# Altium schematic sheet 08_Display_Leds.SchDoc
size 558 x 431 mm
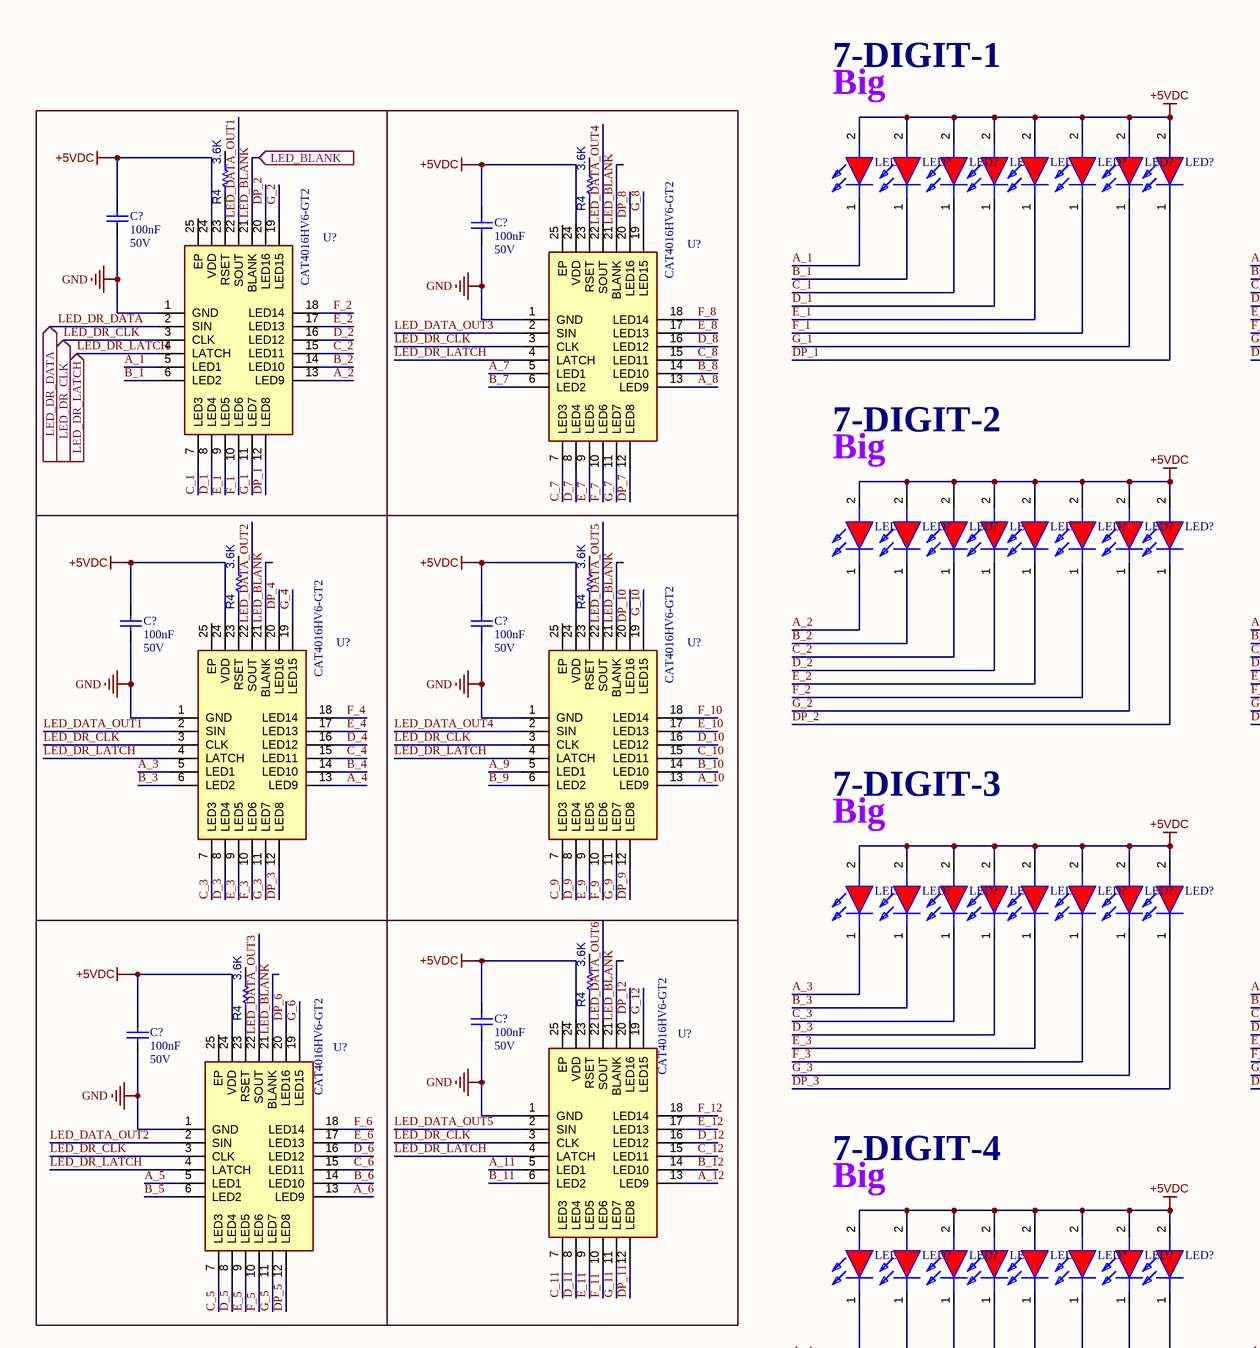
[diagram p0: 08_Display_Leds.SchDoc, top left]
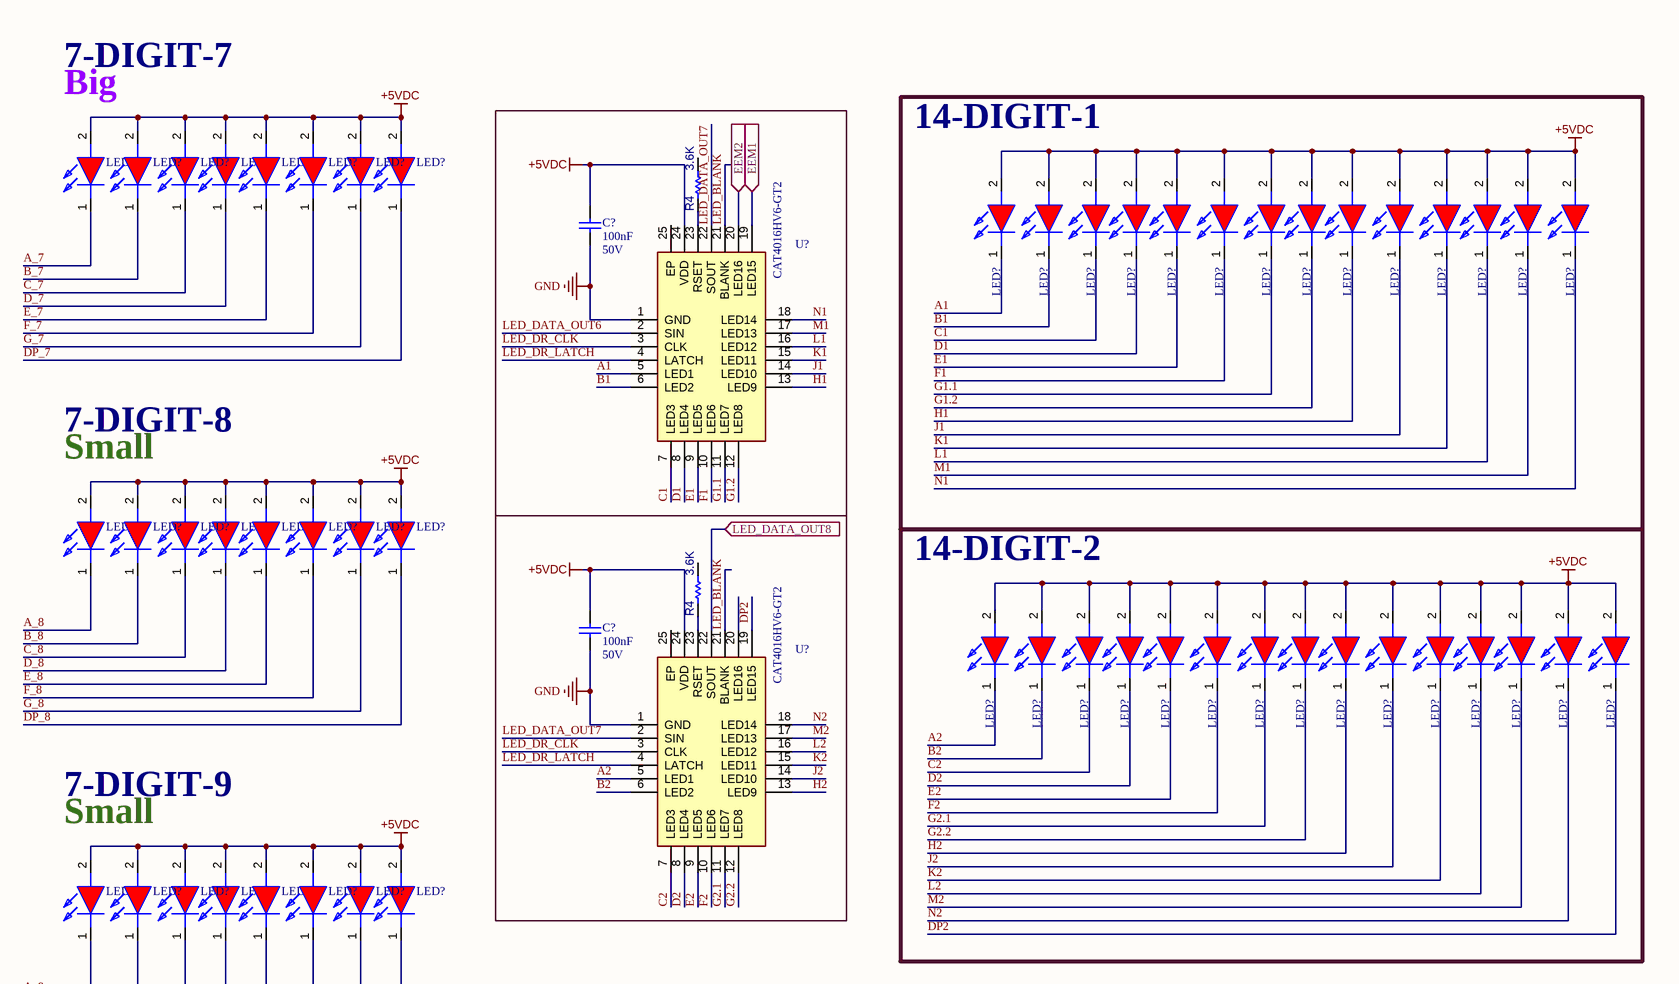
[diagram p1: 08_Display_Leds.SchDoc, top right]
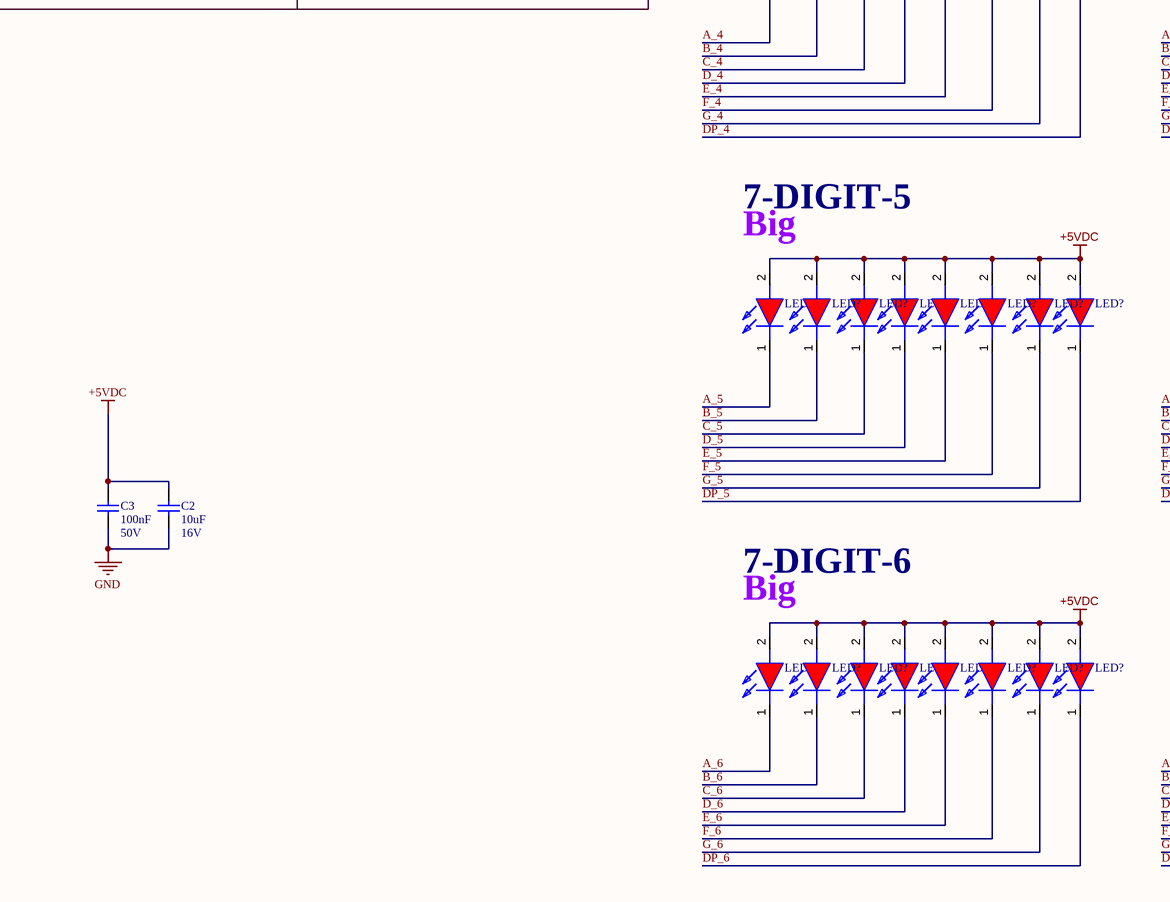
[diagram p2: 08_Display_Leds.SchDoc, bottom left]
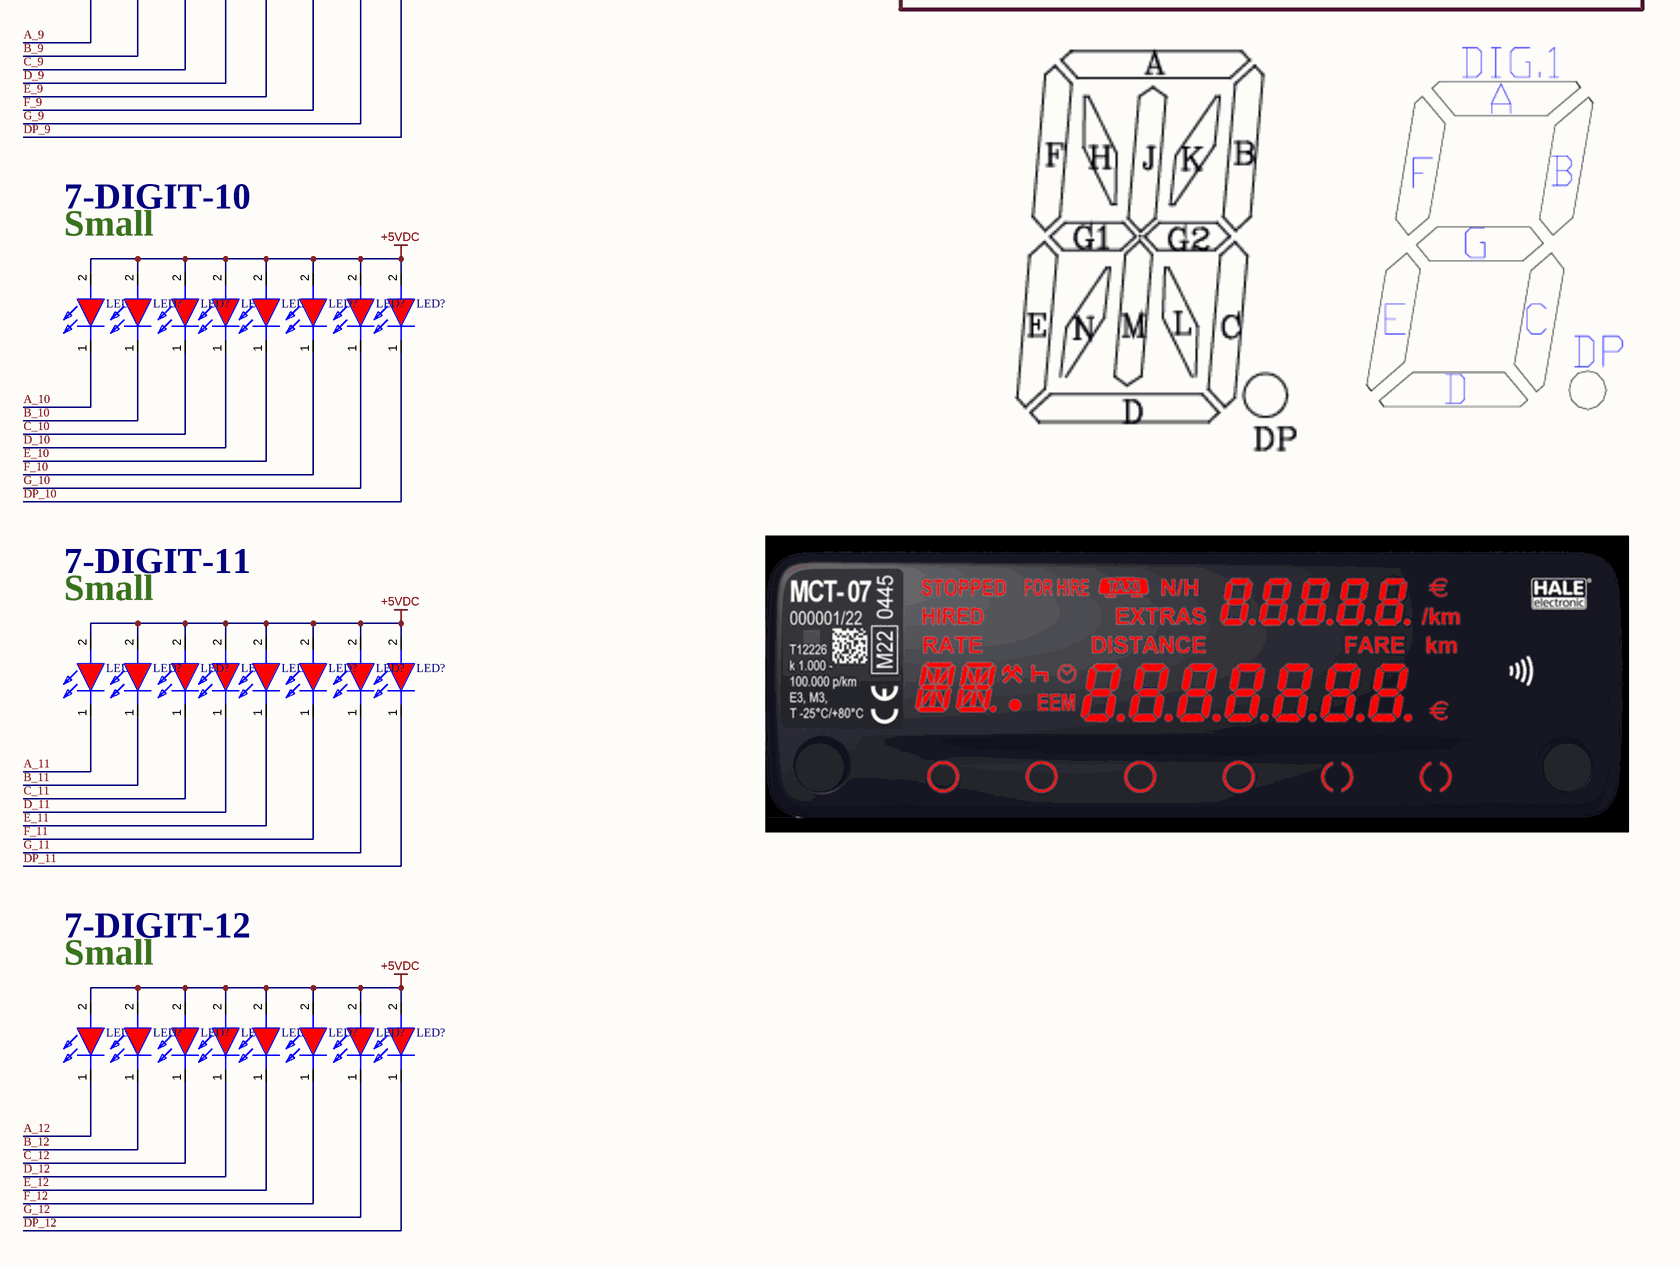
[diagram p3: 08_Display_Leds.SchDoc, bottom right]

## Parts
(Parts that share a designator on the sheet are numbered #1, #2 ... from top to bottom, then left to right.)
C2  value 10uF  Voltage: 16V  [CAP_0805]  (hidden comment: CAP)
C3  value 100nF  Voltage: 50V  [CAP_0603]  (hidden comment: CAP)
C?#1  value 100nF  Voltage: 50V  [CAP_0603]  (hidden comment: CAP)
C?#2  value 100nF  Voltage: 50V  [CAP_0603]  (hidden comment: CAP)
C?#3  value 100nF  Voltage: 50V  [CAP_0603]  (hidden comment: CAP)
C?#4  value 100nF  Voltage: 50V  [CAP_0603]  (hidden comment: CAP)
C?#5  value 100nF  Voltage: 50V  [CAP_0603]  (hidden comment: CAP)
C?#6  value 100nF  Voltage: 50V  [CAP_0603]  (hidden comment: CAP)
C?#7  value 100nF  Voltage: 50V  [CAP_0603]  (hidden comment: CAP)
C?#8  value 100nF  Voltage: 50V  [CAP_0603]  (hidden comment: CAP)
LED?#1  YLED0402R  [APHHS1005LSECKJ3PF]  (value not drawn)
LED?#2  YLED0402R  [APHHS1005LSECKJ3PF]  (value not drawn)
LED?#3  YLED0402R  [APHHS1005LSECKJ3PF]  (value not drawn)
LED?#4  YLED0402R  [APHHS1005LSECKJ3PF]  (value not drawn)
LED?#5  YLED0402R  [APHHS1005LSECKJ3PF]  (value not drawn)
LED?#6  YLED0402R  [APHHS1005LSECKJ3PF]  (value not drawn)
LED?#7  YLED0402R  [APHHS1005LSECKJ3PF]  (value not drawn)
LED?#8  YLED0402R  [APHHS1005LSECKJ3PF]  (value not drawn)
LED?#9  YLED0402R  [APHHS1005LSECKJ3PF]  (value not drawn)
LED?#10  YLED0402R  [APHHS1005LSECKJ3PF]  (value not drawn)
LED?#11  YLED0402R  [APHHS1005LSECKJ3PF]  (value not drawn)
LED?#12  YLED0402R  [APHHS1005LSECKJ3PF]  (value not drawn)
LED?#13  YLED0402R  [APHHS1005LSECKJ3PF]  (value not drawn)
LED?#14  YLED0402R  [APHHS1005LSECKJ3PF]  (value not drawn)
LED?#15  YLED0402R  [APHHS1005LSECKJ3PF]  (value not drawn)
LED?#16  YLED0402R  [APHHS1005LSECKJ3PF]  (value not drawn)
LED?#17  YLED0402R  [APHHS1005LSECKJ3PF]  (value not drawn)
LED?#18  YLED0402R  [APHHS1005LSECKJ3PF]  (value not drawn)
LED?#19  YLED0402R  [APHHS1005LSECKJ3PF]  (value not drawn)
LED?#20  YLED0402R  [APHHS1005LSECKJ3PF]  (value not drawn)
LED?#21  YLED0402R  [APHHS1005LSECKJ3PF]  (value not drawn)
LED?#22  YLED0402R  [APHHS1005LSECKJ3PF]  (value not drawn)
LED?#23  YLED0402R  [APHHS1005LSECKJ3PF]  (value not drawn)
LED?#24  YLED0402R  [APHHS1005LSECKJ3PF]  (value not drawn)
LED?#25  YLED0402R  [APHHS1005LSECKJ3PF]  (value not drawn)
LED?#26  YLED0402R  [APHHS1005LSECKJ3PF]  (value not drawn)
LED?#27  YLED0402R  [APHHS1005LSECKJ3PF]  (value not drawn)
LED?#28  YLED0402R  [APHHS1005LSECKJ3PF]  (value not drawn)
LED?#29  YLED0402R  [APHHS1005LSECKJ3PF]  (value not drawn)
LED?#30  YLED0402R  [APHHS1005LSECKJ3PF]  (value not drawn)
LED?#31  YLED0402R  [APHHS1005LSECKJ3PF]  (value not drawn)
LED?#32  YLED0402R  [APHHS1005LSECKJ3PF]  (value not drawn)
LED?#33  YLED0402R  [APHHS1005LSECKJ3PF]  (value not drawn)
LED?#34  YLED0402R  [APHHS1005LSECKJ3PF]  (value not drawn)
LED?#35  YLED0402R  [APHHS1005LSECKJ3PF]  (value not drawn)
LED?#36  YLED0402R  [APHHS1005LSECKJ3PF]  (value not drawn)
LED?#37  YLED0402R  [APHHS1005LSECKJ3PF]  (value not drawn)
LED?#38  YLED0402R  [APHHS1005LSECKJ3PF]  (value not drawn)
LED?#39  YLED0402R  [APHHS1005LSECKJ3PF]  (value not drawn)
LED?#40  YLED0402R  [APHHS1005LSECKJ3PF]  (value not drawn)
LED?#41  YLED0402R  [APHHS1005LSECKJ3PF]  (value not drawn)
LED?#42  YLED0402R  [APHHS1005LSECKJ3PF]  (value not drawn)
LED?#43  YLED0402R  [APHHS1005LSECKJ3PF]  (value not drawn)
LED?#44  YLED0402R  [APHHS1005LSECKJ3PF]  (value not drawn)
LED?#45  YLED0402R  [APHHS1005LSECKJ3PF]  (value not drawn)
LED?#46  YLED0402R  [APHHS1005LSECKJ3PF]  (value not drawn)
LED?#47  YLED0402R  [APHHS1005LSECKJ3PF]  (value not drawn)
LED?#48  YLED0402R  [APHHS1005LSECKJ3PF]  (value not drawn)
LED?#49  YLED0402R  [APHHS1005LSECKJ3PF]  (value not drawn)
LED?#50  YLED0402R  [APHHS1005LSECKJ3PF]  (value not drawn)
LED?#51  YLED0402R  [APHHS1005LSECKJ3PF]  (value not drawn)
LED?#52  YLED0402R  [APHHS1005LSECKJ3PF]  (value not drawn)
LED?#53  YLED0402R  [APHHS1005LSECKJ3PF]  (value not drawn)
LED?#54  YLED0402R  [APHHS1005LSECKJ3PF]  (value not drawn)
LED?#55  YLED0402R  [APHHS1005LSECKJ3PF]  (value not drawn)
LED?#56  YLED0402R  [APHHS1005LSECKJ3PF]  (value not drawn)
LED?#57  YLED0402R  [APHHS1005LSECKJ3PF]  (value not drawn)
LED?#58  YLED0402R  [APHHS1005LSECKJ3PF]  (value not drawn)
LED?#59  YLED0402R  [APHHS1005LSECKJ3PF]  (value not drawn)
LED?#60  YLED0402R  [APHHS1005LSECKJ3PF]  (value not drawn)
LED?#61  YLED0402R  [APHHS1005LSECKJ3PF]  (value not drawn)
LED?#62  YLED0402R  [APHHS1005LSECKJ3PF]  (value not drawn)
LED?#63  YLED0402R  [APHHS1005LSECKJ3PF]  (value not drawn)
LED?#64  YLED0402R  [APHHS1005LSECKJ3PF]  (value not drawn)
LED?#65  YLED0402R  [APHHS1005LSECKJ3PF]  (value not drawn)
LED?#66  YLED0402R  [APHHS1005LSECKJ3PF]  (value not drawn)
LED?#67  YLED0402R  [APHHS1005LSECKJ3PF]  (value not drawn)
LED?#68  YLED0402R  [APHHS1005LSECKJ3PF]  (value not drawn)
LED?#69  YLED0402R  [APHHS1005LSECKJ3PF]  (value not drawn)
LED?#70  YLED0402R  [APHHS1005LSECKJ3PF]  (value not drawn)
LED?#71  YLED0402R  [APHHS1005LSECKJ3PF]  (value not drawn)
LED?#72  YLED0402R  [APHHS1005LSECKJ3PF]  (value not drawn)
LED?#73  YLED0402R  [APHHS1005LSECKJ3PF]  (value not drawn)
LED?#74  YLED0402R  [APHHS1005LSECKJ3PF]  (value not drawn)
LED?#75  YLED0402R  [APHHS1005LSECKJ3PF]  (value not drawn)
LED?#76  YLED0402R  [APHHS1005LSECKJ3PF]  (value not drawn)
LED?#77  YLED0402R  [APHHS1005LSECKJ3PF]  (value not drawn)
LED?#78  YLED0402R  [APHHS1005LSECKJ3PF]  (value not drawn)
LED?#79  YLED0402R  [APHHS1005LSECKJ3PF]  (value not drawn)
LED?#80  YLED0402R  [APHHS1005LSECKJ3PF]  (value not drawn)
LED?#81  YLED0402R  [APHHS1005LSECKJ3PF]  (value not drawn)
LED?#82  YLED0402R  [APHHS1005LSECKJ3PF]  (value not drawn)
LED?#83  YLED0402R  [APHHS1005LSECKJ3PF]  (value not drawn)
LED?#84  YLED0402R  [APHHS1005LSECKJ3PF]  (value not drawn)
LED?#85  YLED0402R  [APHHS1005LSECKJ3PF]  (value not drawn)
LED?#86  YLED0402R  [APHHS1005LSECKJ3PF]  (value not drawn)
LED?#87  YLED0402R  [APHHS1005LSECKJ3PF]  (value not drawn)
LED?#88  YLED0402R  [APHHS1005LSECKJ3PF]  (value not drawn)
LED?#89  YLED0402R  [APHHS1005LSECKJ3PF]  (value not drawn)
LED?#90  YLED0402R  [APHHS1005LSECKJ3PF]  (value not drawn)
LED?#91  YLED0402R  [APHHS1005LSECKJ3PF]  (value not drawn)
LED?#92  YLED0402R  [APHHS1005LSECKJ3PF]  (value not drawn)
LED?#93  YLED0402R  [APHHS1005LSECKJ3PF]  (value not drawn)
LED?#94  YLED0402R  [APHHS1005LSECKJ3PF]  (value not drawn)
LED?#95  YLED0402R  [APHHS1005LSECKJ3PF]  (value not drawn)
LED?#96  YLED0402R  [APHHS1005LSECKJ3PF]  (value not drawn)
LED?#97  YLED0402R  [APHHS1005LSECKJ3PF]  (value not drawn)
LED?#98  YLED0402R  [APHHS1005LSECKJ3PF]  (value not drawn)
LED?#99  YLED0402R  [APHHS1005LSECKJ3PF]  (value not drawn)
LED?#100  YLED0402R  [APHHS1005LSECKJ3PF]  (value not drawn)
LED?#101  YLED0402R  [APHHS1005LSECKJ3PF]  (value not drawn)
LED?#102  YLED0402R  [APHHS1005LSECKJ3PF]  (value not drawn)
LED?#103  YLED0402R  [APHHS1005LSECKJ3PF]  (value not drawn)
LED?#104  YLED0402R  [APHHS1005LSECKJ3PF]  (value not drawn)
LED?#105  YLED0402R  [APHHS1005LSECKJ3PF]  (value not drawn)
LED?#106  YLED0402R  [APHHS1005LSECKJ3PF]  (value not drawn)
LED?#107  YLED0402R  [APHHS1005LSECKJ3PF]  (value not drawn)
LED?#108  YLED0402R  [APHHS1005LSECKJ3PF]  (value not drawn)
LED?#109  YLED0402R  [APHHS1005LSECKJ3PF]  (value not drawn)
LED?#110  YLED0402R  [APHHS1005LSECKJ3PF]  (value not drawn)
LED?#111  YLED0402R  [APHHS1005LSECKJ3PF]  (value not drawn)
LED?#112  YLED0402R  [APHHS1005LSECKJ3PF]  (value not drawn)
LED?#113  YLED0402R  [APHHS1005LSECKJ3PF]  (value not drawn)
LED?#114  YLED0402R  [APHHS1005LSECKJ3PF]  (value not drawn)
LED?#115  YLED0402R  [APHHS1005LSECKJ3PF]  (value not drawn)
LED?#116  YLED0402R  [APHHS1005LSECKJ3PF]  (value not drawn)
LED?#117  YLED0402R  [APHHS1005LSECKJ3PF]  (value not drawn)
LED?#118  YLED0402R  [APHHS1005LSECKJ3PF]  (value not drawn)
LED?#119  YLED0402R  [APHHS1005LSECKJ3PF]  (value not drawn)
LED?#120  YLED0402R  [APHHS1005LSECKJ3PF]  (value not drawn)
LED?#121  YLED0402R  [APHHS1005LSECKJ3PF]  (value not drawn)
LED?#122  YLED0402R  [APHHS1005LSECKJ3PF]  (value not drawn)
LED?#123  YLED0402R  [APHHS1005LSECKJ3PF]  (value not drawn)
LED?#124  YLED0402R  [APHHS1005LSECKJ3PF]  (value not drawn)
LED?#125  YLED0402R  [APHHS1005LSECKJ3PF]  (value not drawn)
R4#1  value 3.6K  [RES_0603]  (hidden comment: RC0603FR-133K6L)
R4#2  value 3.6K  [RES_0603]  (hidden comment: RC0603FR-133K6L)
R4#3  value 3.6K  [RES_0603]  (hidden comment: RC0603FR-133K6L)
R4#4  value 3.6K  [RES_0603]  (hidden comment: RC0603FR-133K6L)
R4#5  value 3.6K  [RES_0603]  (hidden comment: RC0603FR-133K6L)
R4#6  value 3.6K  [RES_0603]  (hidden comment: RC0603FR-133K6L)
R4#7  value 3.6K  [RES_0603]  (hidden comment: RC0603FR-133K6L)
R4#8  value 3.6K  [RES_0603]  (hidden comment: RC0603FR-133K6L)
U?#1  CAT4016HV6-GT2  [QFN50P400X400X80-25N-D]
U?#2  CAT4016HV6-GT2  [QFN50P400X400X80-25N-D]
U?#3  CAT4016HV6-GT2  [QFN50P400X400X80-25N-D]
U?#4  CAT4016HV6-GT2  [QFN50P400X400X80-25N-D]
U?#5  CAT4016HV6-GT2  [QFN50P400X400X80-25N-D]
U?#6  CAT4016HV6-GT2  [QFN50P400X400X80-25N-D]
U?#7  CAT4016HV6-GT2  [QFN50P400X400X80-25N-D]
U?#8  CAT4016HV6-GT2  [QFN50P400X400X80-25N-D]

## Blocks framed on the sheet
14-DIGIT-1: LED?#17-LED?#30
14-DIGIT-2: LED?#47-LED?#61

## Ports
EEM1 (in), EEM2 (in), LED_BLANK (in), LED_DATA_OUT8 (in), LED_DR_CLK (in), LED_DR_DATA (in), LED_DR_LATCH (in)

## Nets
+5VDC: C2.1 C3.1 C?#1.1 C?#2.1 C?#3.1 C?#4.1 C?#5.1 C?#6.1 C?#7.1 C?#8.1 LED?#1.2(A) LED?#2.2(A) LED?#3.2(A) LED?#4.2(A) LED?#5.2(A) LED?#6.2(A) LED?#7.2(A) LED?#8.2(A) LED?#9.2(A) LED?#10.2(A) LED?#11.2(A) LED?#12.2(A) LED?#13.2(A) LED?#14.2(A) LED?#15.2(A) LED?#16.2(A) LED?#17.2(A) LED?#18.2(A) LED?#19.2(A) LED?#20.2(A) LED?#21.2(A) LED?#22.2(A) LED?#23.2(A) LED?#24.2(A) LED?#25.2(A) LED?#26.2(A) LED?#27.2(A) LED?#28.2(A) LED?#29.2(A) LED?#30.2(A) LED?#31.2(A) LED?#32.2(A) LED?#33.2(A) LED?#34.2(A) LED?#35.2(A) LED?#36.2(A) LED?#37.2(A) LED?#38.2(A) LED?#39.2(A) LED?#40.2(A) LED?#41.2(A) LED?#42.2(A) LED?#43.2(A) LED?#44.2(A) LED?#45.2(A) LED?#46.2(A) LED?#47.2(A) LED?#48.2(A) LED?#49.2(A) LED?#50.2(A) LED?#51.2(A) LED?#52.2(A) LED?#53.2(A) LED?#54.2(A) LED?#55.2(A) LED?#56.2(A) LED?#57.2(A) LED?#58.2(A) LED?#59.2(A) LED?#60.2(A) LED?#61.2(A) LED?#62.2(A) LED?#63.2(A) LED?#64.2(A) LED?#65.2(A) LED?#66.2(A) LED?#67.2(A) LED?#68.2(A) LED?#69.2(A) LED?#70.2(A) LED?#71.2(A) LED?#72.2(A) LED?#73.2(A) LED?#74.2(A) LED?#75.2(A) LED?#76.2(A) LED?#77.2(A) LED?#78.2(A) LED?#79.2(A) LED?#80.2(A) LED?#81.2(A) LED?#82.2(A) LED?#83.2(A) LED?#84.2(A) LED?#85.2(A) LED?#86.2(A) LED?#87.2(A) LED?#88.2(A) LED?#89.2(A) LED?#90.2(A) LED?#91.2(A) LED?#92.2(A) LED?#93.2(A) LED?#94.2(A) LED?#95.2(A) LED?#96.2(A) LED?#97.2(A) LED?#98.2(A) LED?#99.2(A) LED?#100.2(A) LED?#101.2(A) LED?#102.2(A) LED?#103.2(A) LED?#104.2(A) LED?#105.2(A) LED?#106.2(A) LED?#107.2(A) LED?#108.2(A) LED?#109.2(A) LED?#110.2(A) LED?#111.2(A) LED?#112.2(A) LED?#113.2(A) LED?#114.2(A) LED?#115.2(A) LED?#116.2(A) LED?#117.2(A) LED?#118.2(A) LED?#119.2(A) LED?#120.2(A) LED?#121.2(A) LED?#122.2(A) LED?#123.2(A) LED?#124.2(A) LED?#125.2(A) U?#1.24(VDD) U?#2.24(VDD) U?#3.24(VDD) U?#4.24(VDD) U?#5.24(VDD) U?#6.24(VDD) U?#7.24(VDD) U?#8.24(VDD)
GND: C2.2 C3.2 C?#1.2 C?#2.2 C?#3.2 C?#4.2 C?#5.2 C?#6.2 C?#7.2 C?#8.2 U?#1.1(GND) U?#2.1(GND) U?#3.1(GND) U?#4.1(GND) U?#5.1(GND) U?#6.1(GND) U?#7.1(GND) U?#8.1(GND)
A1: LED?#17.1(K) U?#3.5(LED1)
A2: LED?#47.1(K) U?#6.5(LED1)
A_1: LED?#1.1(K) U?#1.5(LED1)
A_2: LED?#31.1(K) U?#1.13(LED9)
A_3: LED?#62.1(K) U?#4.5(LED1)
A_4: LED?#78.1(K) U?#4.13(LED9)
A_5: LED?#94.1(K) U?#8.5(LED1)
A_6: LED?#110.1(K) U?#8.13(LED9)
A_7: LED?#9.1(K) U?#2.5(LED1)
A_8: LED?#39.1(K) U?#2.13(LED9)
A_9: LED?#70.1(K) U?#5.5(LED1)
A_10: LED?#86.1(K) U?#5.13(LED9)
A_11: LED?#102.1(K) U?#7.5(LED1)
A_12: LED?#118.1(K) U?#7.13(LED9)
B1: LED?#18.1(K) U?#3.6(LED2)
B2: LED?#48.1(K) U?#6.6(LED2)
B_1: LED?#2.1(K) U?#1.6(LED2)
B_2: LED?#32.1(K) U?#1.14(LED10)
B_3: LED?#63.1(K) U?#4.6(LED2)
B_4: LED?#79.1(K) U?#4.14(LED10)
B_5: LED?#95.1(K) U?#8.6(LED2)
B_6: LED?#111.1(K) U?#8.14(LED10)
B_7: LED?#10.1(K) U?#2.6(LED2)
B_8: LED?#40.1(K) U?#2.14(LED10)
B_9: LED?#71.1(K) U?#5.6(LED2)
B_10: LED?#87.1(K) U?#5.14(LED10)
B_11: LED?#103.1(K) U?#7.6(LED2)
B_12: LED?#119.1(K) U?#7.14(LED10)
C1: LED?#19.1(K) U?#3.7(LED3)
C2: LED?#49.1(K) U?#6.7(LED3)
C_1: LED?#3.1(K) U?#1.7(LED3)
C_2: LED?#33.1(K) U?#1.15(LED11)
C_3: LED?#64.1(K) U?#4.7(LED3)
C_4: LED?#80.1(K) U?#4.15(LED11)
C_5: LED?#96.1(K) U?#8.7(LED3)
C_6: LED?#112.1(K) U?#8.15(LED11)
C_7: LED?#11.1(K) U?#2.7(LED3)
C_8: LED?#41.1(K) U?#2.15(LED11)
C_9: LED?#72.1(K) U?#5.7(LED3)
C_10: LED?#88.1(K) U?#5.15(LED11)
C_11: LED?#104.1(K) U?#7.7(LED3)
C_12: LED?#120.1(K) U?#7.15(LED11)
D1: LED?#20.1(K) U?#3.8(LED4)
D2: LED?#50.1(K) U?#6.8(LED4)
D_1: LED?#4.1(K) U?#1.8(LED4)
D_2: LED?#34.1(K) U?#1.16(LED12)
D_3: LED?#65.1(K) U?#4.8(LED4)
D_4: LED?#81.1(K) U?#4.16(LED12)
D_5: LED?#97.1(K) U?#8.8(LED4)
D_6: LED?#113.1(K) U?#8.16(LED12)
D_7: LED?#12.1(K) U?#2.8(LED4)
D_8: LED?#42.1(K) U?#2.16(LED12)
D_9: LED?#73.1(K) U?#5.8(LED4)
D_10: LED?#89.1(K) U?#5.16(LED12)
D_11: LED?#105.1(K) U?#7.8(LED4)
D_12: LED?#121.1(K) U?#7.16(LED12)
DP2: LED?#61.1(K) U?#6.19(LED15)
DP_1: LED?#8.1(K) U?#1.12(LED8)
DP_2: LED?#38.1(K) U?#1.20(LED16)
DP_3: LED?#69.1(K) U?#4.12(LED8)
DP_4: LED?#85.1(K) U?#4.20(LED16)
DP_5: LED?#101.1(K) U?#8.12(LED8)
DP_6: LED?#117.1(K) U?#8.20(LED16)
DP_7: LED?#16.1(K) U?#2.12(LED8)
DP_8: LED?#46.1(K) U?#2.20(LED16)
DP_9: LED?#77.1(K) U?#5.12(LED8)
DP_10: LED?#93.1(K) U?#5.20(LED16)
DP_11: LED?#109.1(K) U?#7.12(LED8)
DP_12: LED?#125.1(K) U?#7.20(LED16)
E1: LED?#21.1(K) U?#3.9(LED5)
E2: LED?#51.1(K) U?#6.9(LED5)
E_1: LED?#5.1(K) U?#1.9(LED5)
E_2: LED?#35.1(K) U?#1.17(LED13)
E_3: LED?#66.1(K) U?#4.9(LED5)
E_4: LED?#82.1(K) U?#4.17(LED13)
E_5: LED?#98.1(K) U?#8.9(LED5)
E_6: LED?#114.1(K) U?#8.17(LED13)
E_7: LED?#13.1(K) U?#2.9(LED5)
E_8: LED?#43.1(K) U?#2.17(LED13)
E_9: LED?#74.1(K) U?#5.9(LED5)
E_10: LED?#90.1(K) U?#5.17(LED13)
E_11: LED?#106.1(K) U?#7.9(LED5)
E_12: LED?#122.1(K) U?#7.17(LED13)
EEM1: U?#3.19(LED15) ; port EEM1
EEM2: U?#3.20(LED16) ; port EEM2
F1: LED?#22.1(K) U?#3.10(LED6)
F2: LED?#52.1(K) U?#6.10(LED6)
F_1: LED?#6.1(K) U?#1.10(LED6)
F_2: LED?#36.1(K) U?#1.18(LED14)
F_3: LED?#67.1(K) U?#4.10(LED6)
F_4: LED?#83.1(K) U?#4.18(LED14)
F_5: LED?#99.1(K) U?#8.10(LED6)
F_6: LED?#115.1(K) U?#8.18(LED14)
F_7: LED?#14.1(K) U?#2.10(LED6)
F_8: LED?#44.1(K) U?#2.18(LED14)
F_9: LED?#75.1(K) U?#5.10(LED6)
F_10: LED?#91.1(K) U?#5.18(LED14)
F_11: LED?#107.1(K) U?#7.10(LED6)
F_12: LED?#123.1(K) U?#7.18(LED14)
G1.1: LED?#23.1(K) U?#3.11(LED7)
G1.2: LED?#24.1(K) U?#3.12(LED8)
G2.1: LED?#53.1(K) U?#6.11(LED7)
G2.2: LED?#54.1(K) U?#6.12(LED8)
G_1: LED?#7.1(K) U?#1.11(LED7)
G_2: LED?#37.1(K) U?#1.19(LED15)
G_3: LED?#68.1(K) U?#4.11(LED7)
G_4: LED?#84.1(K) U?#4.19(LED15)
G_5: LED?#100.1(K) U?#8.11(LED7)
G_6: LED?#116.1(K) U?#8.19(LED15)
G_7: LED?#15.1(K) U?#2.11(LED7)
G_8: LED?#45.1(K) U?#2.19(LED15)
G_9: LED?#76.1(K) U?#5.11(LED7)
G_10: LED?#92.1(K) U?#5.19(LED15)
G_11: LED?#108.1(K) U?#7.11(LED7)
G_12: LED?#124.1(K) U?#7.19(LED15)
H1: LED?#25.1(K) U?#3.13(LED9)
H2: LED?#55.1(K) U?#6.13(LED9)
J1: LED?#26.1(K) U?#3.14(LED10)
J2: LED?#56.1(K) U?#6.14(LED10)
K1: LED?#27.1(K) U?#3.15(LED11)
K2: LED?#57.1(K) U?#6.15(LED11)
L1: LED?#28.1(K) U?#3.16(LED12)
L2: LED?#58.1(K) U?#6.16(LED12)
LED_BLANK: U?#1.21(BLANK) U?#2.21(BLANK) U?#3.21(BLANK) U?#4.21(BLANK) U?#5.21(BLANK) U?#6.21(BLANK) U?#7.21(BLANK) U?#8.21(BLANK) ; port LED_BLANK
LED_DATA_OUT1: U?#1.22(SOUT) U?#4.2(SIN)
LED_DATA_OUT2: U?#4.22(SOUT) U?#8.2(SIN)
LED_DATA_OUT3: U?#2.2(SIN) U?#8.22(SOUT)
LED_DATA_OUT4: U?#2.22(SOUT) U?#5.2(SIN)
LED_DATA_OUT5: U?#5.22(SOUT) U?#7.2(SIN)
LED_DATA_OUT6: U?#3.2(SIN) U?#7.22(SOUT)
LED_DATA_OUT7: U?#3.22(SOUT) U?#6.2(SIN)
LED_DATA_OUT8: U?#6.22(SOUT) ; port LED_DATA_OUT8
LED_DR_CLK: U?#1.3(CLK) U?#2.3(CLK) U?#3.3(CLK) U?#4.3(CLK) U?#5.3(CLK) U?#6.3(CLK) U?#7.3(CLK) U?#8.3(CLK) ; port LED_DR_CLK
LED_DR_DATA: U?#1.2(SIN) ; port LED_DR_DATA
LED_DR_LATCH: U?#1.4(LATCH) U?#2.4(LATCH) U?#3.4(LATCH) U?#4.4(LATCH) U?#5.4(LATCH) U?#6.4(LATCH) U?#7.4(LATCH) U?#8.4(LATCH) ; port LED_DR_LATCH
M1: LED?#29.1(K) U?#3.17(LED13)
M2: LED?#59.1(K) U?#6.17(LED13)
N1: LED?#30.1(K) U?#3.18(LED14)
N2: LED?#60.1(K) U?#6.18(LED14)
NetR4#1_1: R4#1.1 U?#1.23(RSET)
NetR4#2_1: R4#2.1 U?#2.23(RSET)
NetR4#3_1: R4#3.1 U?#3.23(RSET)
NetR4#4_1: R4#4.1 U?#4.23(RSET)
NetR4#5_1: R4#5.1 U?#5.23(RSET)
NetR4#6_1: R4#6.1 U?#6.23(RSET)
NetR4#7_1: R4#7.1 U?#7.23(RSET)
NetR4#8_1: R4#8.1 U?#8.23(RSET)

Not connected (* = marked no-connect by the designer): R4#1 2; R4#2 2; R4#3 2; R4#4 2; R4#5 2; R4#6 2; R4#7 2; R4#8 2; U?#1 25(EP); U?#2 25(EP); U?#3 25(EP); U?#4 25(EP); U?#5 25(EP); U?#6 20(LED16) 25(EP); U?#7 25(EP); U?#8 25(EP)

## Notes on the sheet
- 7-DIGIT-1
- (near LED?#1) Big
- 7-DIGIT-7
- (near LED?#9) Big
- 7-DIGIT-2
- (near LED?#31) Big
- 7-DIGIT-8
- (near LED?#39) Small
- 7-DIGIT-3
- 7-DIGIT-9
- (near LED?#62) Big
- (near LED?#70) Small
- 7-DIGIT-4
- (near LED?#78) Big
- 7-DIGIT-10
- (near LED?#86) Small
- 7-DIGIT-5
- 7-DIGIT-11
- (near LED?#94) Big
- (near LED?#102) Small
- 7-DIGIT-6
- 7-DIGIT-12
- (near LED?#110) Big
- (near LED?#118) Small
- DWG. NO.
- REV.
- SHT.
- REVISION
- DESCRIPTION
- DATE
- APPROVED
- THIS DOCUMENT AND THE DATA DISCLOSED HEREIN OR HEREWITH IS THE PROPERTY OF ALTIUM LIMITED AND MAY BE FREELY DISTRIBUTED IN WHOLE. NO RIGHTS ARE RESERVED OR EXPRESS OR IMPLIED WARANTEE GIVEN.
- ENG:
- DSN:
- APPROVALS
- PROJECT
- DOCUMENT REVISION:
- DESIGN ITEM:
- CHK:
- BOM:
- REFERENCE DOCUMENTS
- PROJECT REVISION:
- TITLE
- FAB DWG:
- PCB DWG:
- ASSY DWG:
- SCALE:
- SIZE
- C
- CAGE CODE
- FILE NAME
- DWG NO.
- SHEET
- OF
- REV

## Library data of the parts
C2 = C01758: CAP CER 10UF 16VDC %10 X5R SMD; Manufacturer: Samsung; Manufacturer Part Number: CL21A106KOQNNNE
C3 C?#1-C?#8 = C01763: CAP CER 100nF 50VDC %10 X7R SMD; Manufacturer: Samsung; Manufacturer Part Number: CL10B104KB8NNNL
LED?#1-LED?#125 = YLED0402R: LED RED WATER CLEAR 0402 SMD; Manufacturer: Kingbright; Value: 0402; Manufacturer Part Number: YLED0402R
R4#1-R4#8 = 0603SAF3301T5E: RES.(1608) 0603 3.6K Ohms 1% 1/10W 100PPM SMT; Manufacturer: YAGEO; Manufacturer Part Number: RC0603FR-133K6L
U?#1-U?#8 = CAT4016HV6-GT2: Integrated Circuit; Manufacturer_Name: onsemi; Datasheet Link: https://www.onsemi.com/download/data-sheet/pdf/cat4016-d.pdf; Height: 0.8mm; Manufacturer_Part_Number: CAT4016HV6-GT2; Mouser Part Number: 698-CAT4016HV6-GT2; Mouser Price/Stock: https://www.mouser.co.uk/ProductDetail/onsemi/CAT4016HV6-GT2?qs=rZgeL6XvLwaPp0eUTTX%2FiA%3D%3D; Arrow Part Number: CAT4016HV6-GT2; Arrow Price/Stock: https://www.arrow.com/en/products/cat4016hv6-gt2/on-semiconductor